# Altium schematic sheet Trepanat_MCU.SchDoc: Трепанат
size 840 x 594 mm; ApprovedBy: Подлесный; CheckedBy: Подлесный; CompanyName: ВольтПРО; DrawnBy: Подлесный; DocumentNumber: ПРО 2018.001 Э3; SheetNumber: 1; SheetTotal: 7; DocumentType: Схема электрическая принципиальная; Format: A1; ImagePath: Введите номер платы
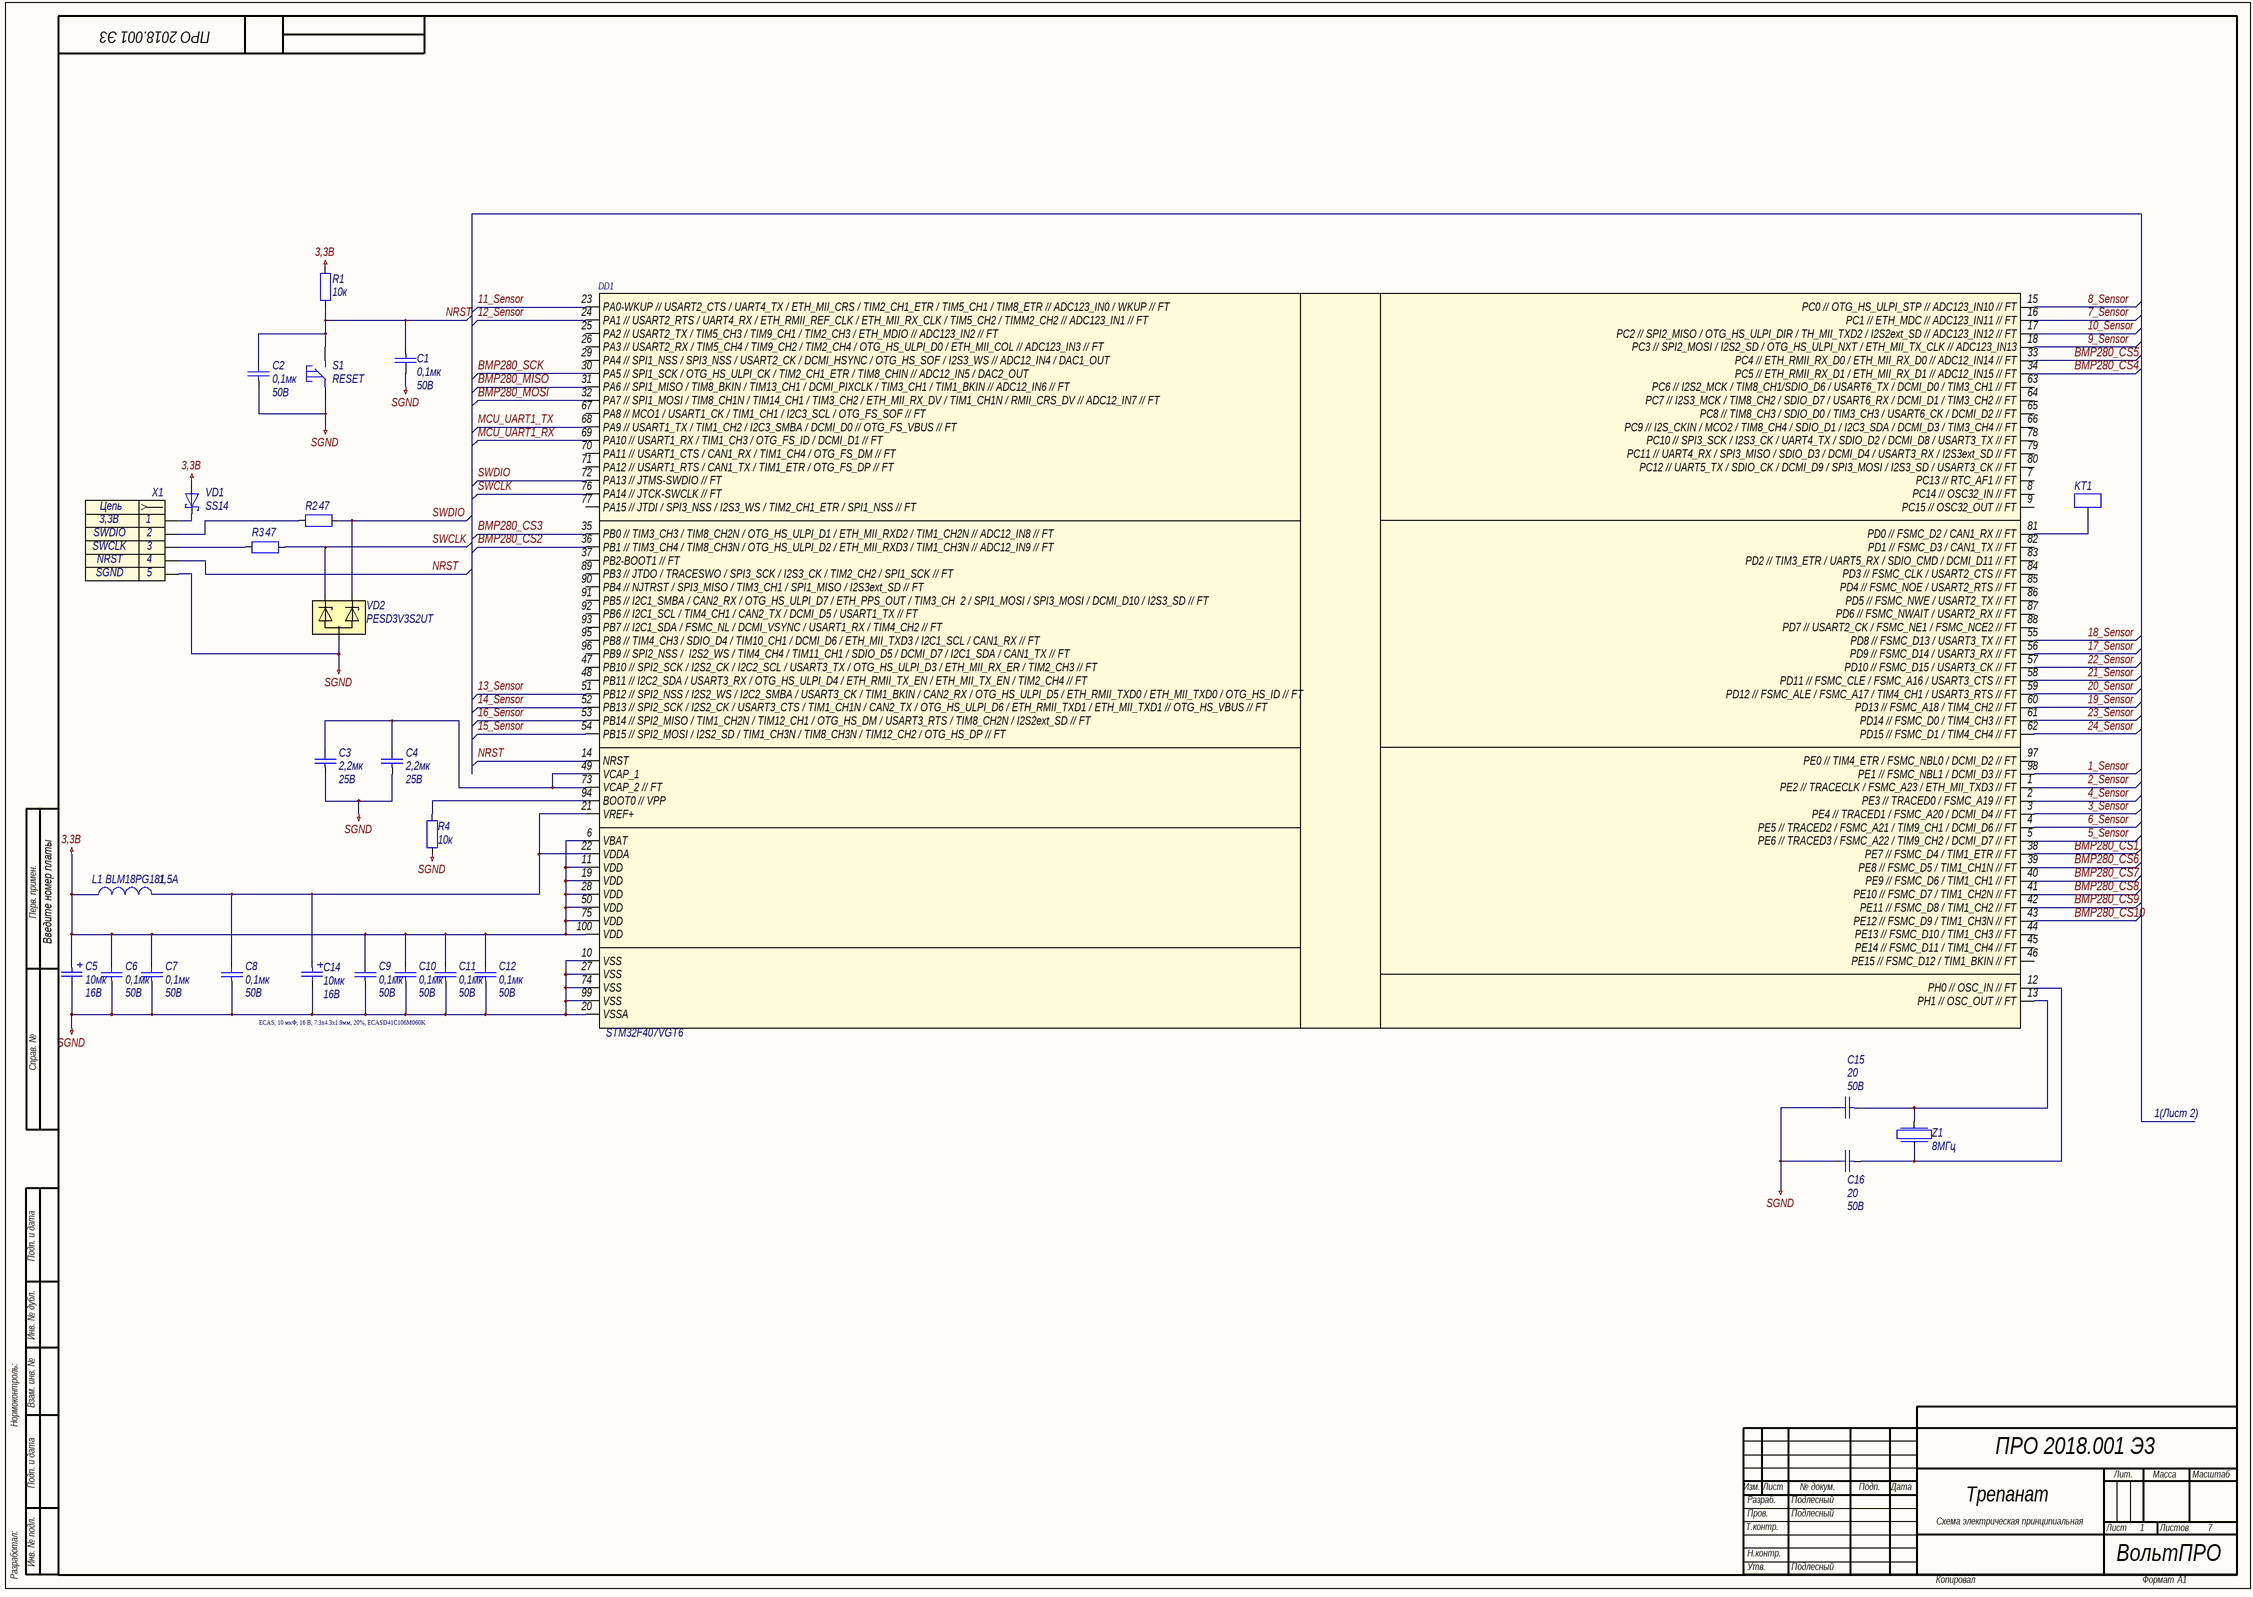
[diagram p0: Trepanat_MCU.SchDoc]

## Parts
C1  0,1мк  Voltage: 50В  [C0805]
C2  0,1мк  Voltage: 50В  [C0805]
C3  2,2мк  Voltage: 25В  [C0805]
C4  2,2мк  Voltage: 25В  [C0805]
C5  Voltage: 16В  [TANTAL CASE D]  (hidden comment: 10мк)
C6  0,1мк  Voltage: 50В  [C0805]
C7  0,1мк  Voltage: 50В  [C0805]
C8  0,1мк  Voltage: 50В  [C0805]
C9  0,1мк  Voltage: 50В  [C0805]
C10  0,1мк  Voltage: 50В  [C0805]
C11  0,1мк  Voltage: 50В  [C0805]
C12  0,1мк  Voltage: 50В  [C0805]
C14  Voltage: 16В  [TANTAL CASE D]  (hidden comment: 10мк)
C15  20  Voltage: 50В  [C0805]
C16  Voltage: 50В  [C0805]  (hidden comment: 20)
DD1  (no value)  [LQPF100]
KT1  KT  [КТ]  (value not drawn)
L1  BLM18PG181  Imax: 1,5A  [L0603]
R1  10к  [R0805]
R2  47  [R0805]
R3  47  [R0805]
R4  10к  [R0805]
S1  RESET  [Button_SMD]
VD1  SS14  [SMA]
VD2  PESD3V3S2UT  [SOT23-3]
X1  (no value)  [PLS-5]
Z1  8МГц  [QSMD5.0x3.2x1.0]

## Nets
3,3B: C5.1 C6.2 C7.2 C9.2 C10.2 C11.2 C12.2 DD1.6(VBAT) DD1.11(VDD) DD1.19(VDD) DD1.28(VDD) DD1.50(VDD) DD1.75(VDD) DD1.100(VDD) L1.1 R1.2 VD1.2(A)
SGND: C1.2 C2.1 C3.1 C4.1 C5.2 C6.1 C7.1 C8.1 C9.1 C10.1 C11.1 C12.1 C14.2 C15.2 C16.2 DD1.10(VSS) DD1.20(VSSA) DD1.27(VSS) DD1.74(VSS) DD1.99(VSS) R4.2 S1.1 VD2.3 X1.5
1_Sensor: DD1.98(PE1_//_FSMC_NBL1_/_DCMI_D3_//_FT)
2_Sensor: DD1.1(PE2_//_TRACECLK_/_FSMC_A23_/_ETH_MII_TXD3_//_FT)
3_Sensor: DD1.3(PE4_//_TRACED1_/_FSMC_A20_/_DCMI_D4_//_FT)
4_Sensor: DD1.2(PE3_//_TRACED0_/_FSMC_A19_//_FT)
5_Sensor: DD1.5(PE6_//_TRACED3_/_FSMC_A22_/_TIM9_CH2_/_DCMI_D7_//_FT)
6_Sensor: DD1.4(PE5_//_TRACED2_/_FSMC_A21_/_TIM9_CH1_/_DCMI_D6_//_FT)
7_Sensor: DD1.16(PC1_//_ETH_MDC_//_ADC123_IN11_//_FT)
8_Sensor: DD1.15(PC0_//_OTG_HS_ULPI_STP_//_ADC123_IN10_//_FT)
9_Sensor: DD1.18(PC3_//_SPI2_MOSI_/_I2S2_SD_/_OTG_HS_ULPI_NXT_/_ETH_MII_TX_CLK_//_ADC123_IN13)
10_Sensor: DD1.17(PC2_//_SPI2_MISO_/_OTG_HS_ULPI_DIR_/_TH_MII_TXD2_/_I2S2ext_SD_//_ADC123_IN12_//_FT)
11_Sensor: DD1.23(PA0-WKUP_//_USART2_CTS_/_UART4_TX_/_ETH_MII_CRS_/_TIM2_CH1_ETR_/_TIM5_CH1_/_TIM8_ETR_//_ADC123_IN0_/_WKUP_//_FT)
12_Sensor: DD1.24(PA1_//_USART2_RTS_/_UART4_RX_/_ETH_RMII_REF_CLK_/_ETH_MII_RX_CLK_/_TIM5_CH2_/_TIMM2_CH2_//_ADC123_IN1_//_FT)
13_Sensor: DD1.51(PB12_//_SPI2_NSS_/_I2S2_WS_/_I2C2_SMBA_/_USART3_CK_/_TIM1_BKIN_/_CAN2_RX_/_OTG_HS_ULPI_D5_/_ETH_RMII_TXD0_/_ETH_MII_TXD0_/_OTG_HS_ID_//_FT)
14_Sensor: DD1.52(PB13_//_SPI2_SCK_/_I2S2_CK_/_USART3_CTS_/_TIM1_CH1N_/_CAN2_TX_/_OTG_HS_ULPI_D6_/_ETH_RMII_TXD1_/_ETH_MII_TXD1_//_OTG_HS_VBUS_//_FT)
15_Sensor: DD1.54(PB15_//_SPI2_MOSI_/_I2S2_SD_/_TIM1_CH3N_/_TIM8_CH3N_/_TIM12_CH2_/_OTG_HS_DP_//_FT)
16_Sensor: DD1.53(PB14_//_SPI2_MISO_/_TIM1_CH2N_/_TIM12_CH1_/_OTG_HS_DM_/_USART3_RTS_/_TIM8_CH2N_/_I2S2ext_SD_//_FT)
17_Sensor: DD1.56(PD9_//_FSMC_D14_/_USART3_RX_//_FT)
18_Sensor: DD1.55(PD8_//_FSMC_D13_/_USART3_TX_//_FT)
19_Sensor: DD1.60(PD13_//_FSMC_A18_/_TIM4_CH2_//_FT)
20_Sensor: DD1.59(PD12_//_FSMC_ALE_/_FSMC_A17_/_TIM4_CH1_/_USART3_RTS_//_FT)
21_Sensor: DD1.58(PD11_//_FSMC_CLE_/_FSMC_A16_/_USART3_CTS_//_FT)
22_Sensor: DD1.57(PD10_//_FSMC_D15_/_USART3_CK_//_FT)
23_Sensor: DD1.61(PD14_//_FSMC_D0_/_TIM4_CH3_//_FT)
24_Sensor: DD1.62(PD15_//_FSMC_D1_/_TIM4_CH4_//_FT)
BMP280_CS1: DD1.38(PE7_//_FSMC_D4_/_TIM1_ETR_//_FT)
BMP280_CS2: DD1.36(PB1_//_TIM3_CH4_/_TIM8_CH3N_/_OTG_HS_ULPI_D2_/_ETH_MII_RXD3_/_TIM1_CH3N_//_ADC12_IN9_//_FT)
BMP280_CS3: DD1.35(PB0_//_TIM3_CH3_/_TIM8_CH2N_/_OTG_HS_ULPI_D1_/_ETH_MII_RXD2_/_TIM1_CH2N_//_ADC12_IN8_//_FT)
BMP280_CS4: DD1.34(PC5_//_ETH_RMII_RX_D1_/_ETH_MII_RX_D1_//_ADC12_IN15_//_FT)
BMP280_CS5: DD1.33(PC4_//_ETH_RMII_RX_D0_/_ETH_MII_RX_D0_//_ADC12_IN14_//_FT)
BMP280_CS6: DD1.39(PE8_//_FSMC_D5_/_TIM1_CH1N_//_FT)
BMP280_CS7: DD1.40(PE9_//_FSMC_D6_/_TIM1_CH1_//_FT)
BMP280_CS8: DD1.41(PE10_//_FSMC_D7_/_TIM1_CH2N_//_FT)
BMP280_CS9: DD1.42(PE11_//_FSMC_D8_/_TIM1_CH2_//_FT)
BMP280_CS10: DD1.43(PE12_//_FSMC_D9_/_TIM1_CH3N_//_FT)
BMP280_MISO: DD1.31(PA6_//_SPI1_MISO_/_TIM8_BKIN_/_TIM13_CH1_/_DCMI_PIXCLK_/_TIM3_CH1_/_TIM1_BKIN_//_ADC12_IN6_//_FT)
BMP280_MOSI: DD1.32(PA7_//_SPI1_MOSI_/_TIM8_CH1N_/_TIM14_CH1_/_TIM3_CH2_/_ETH_MII_RX_DV_/_TIM1_CH1N_/_RMII_CRS_DV_//_ADC12_IN7_//_FT)
BMP280_SCK: DD1.30(PA5_//_SPI1_SCK_/_OTG_HS_ULPI_CK_/_TIM2_CH1_ETR_/_TIM8_CHIN_//_ADC12_IN5_/_DAC2_OUT)
MCU_UART1_RX: DD1.69(PA10_//_USART1_RX_/_TIM1_CH3_/_OTG_FS_ID_/_DCMI_D1_//_FT)
MCU_UART1_TX: DD1.68(PA9_//_USART1_TX_/_TIM1_CH2_/_I2C3_SMBA_/_DCMI_D0_//_OTG_FS_VBUS_//_FT)
NRST: C1.1 C2.2 DD1.14(NRST) R1.1 S1.4 X1.4
SWCLK: DD1.76(PA14_//_JTCK-SWCLK_//_FT) R3.1 VD2.1
SWDIO: DD1.72(PA13_//_JTMS-SWDIO_//_FT) R2.1 VD2.2
NetC3_2: C3.2 C4.2 DD1.49(VCAP_1) DD1.73(VCAP_2_//_FT)
NetC8_2: C8.2 C14.1 DD1.21(VREF+) DD1.22(VDDA) L1.2
NetC15_1: C15.1 DD1.13(PH1_//_OSC_OUT_//_FT) Z1.2
NetC16_1: C16.1 DD1.12(PH0_//_OSC_IN_//_FT) Z1.1
NetDD1_81: DD1.81(PD0_//_FSMC_D2_/_CAN1_RX_//_FT) KT1.1
NetDD1_94: DD1.94(BOOT0_//_VPP) R4.1
NetR2_2: R2.2 X1.2
NetR3_2: R3.2 X1.3
NetVD1_1: VD1.1(K) X1.1

Not connected (* = marked no-connect by the designer): DD1 7(PC13_//_RTC_AF1_//_FT) 8(PC14_//_OSC32_IN_//_FT) 9(PC15_//_OSC32_OUT_//_FT) 25(PA2_//_USART2_TX_/_TIM5_CH3_/_TIM9_CH1_/_TIM2_CH3_/_ETH_MDIO_//_ADC123_IN2_//_FT) 26(PA3_//_USART2_RX_/_TIM5_CH4_/_TIM9_CH2_/_TIM2_CH4_/_OTG_HS_ULPI_D0_/_ETH_MII_COL_//_ADC123_IN3_//_FT) 29(PA4_//_SPI1_NSS_/_SPI3_NSS_/_USART2_CK_/_DCMI_HSYNC_/_OTG_HS_SOF_/_I2S3_WS_//_ADC12_IN4_/_DAC1_OUT) 37(PB2-BOOT1_//_FT) 44(PE13_//_FSMC_D10_/_TIM1_CH3_//_FT) 45(PE14_//_FSMC_D11_/_TIM1_CH4_//_FT) 46(PE15_//_FSMC_D12_/_TIM1_BKIN_//_FT) 47(PB10_//_SPI2_SCK_/_I2S2_CK_/_I2C2_SCL_/_USART3_TX_/_OTG_HS_ULPI_D3_/_ETH_MII_RX_ER_/_TIM2_CH3_//_FT) 48(PB11_//_I2C2_SDA_/_USART3_RX_/_OTG_HS_ULPI_D4_/_ETH_RMII_TX_EN_/_ETH_MII_TX_EN_/_TIM2_CH4_//_FT) 63(PC6_//_I2S2_MCK_/_TIM8_CH1/SDIO_D6_/_USART6_TX_/_DCMI_D0_/_TIM3_CH1_//_FT) 64(PC7_//_I2S3_MCK_/_TIM8_CH2_/_SDIO_D7_/_USART6_RX_/_DCMI_D1_/_TIM3_CH2_//_FT) 65(PC8_//_TIM8_CH3_/_SDIO_D0_/_TIM3_CH3_/_USART6_CK_/_DCMI_D2_//_FT) 66(PC9_//_I2S_CKIN_/_MCO2_/_TIM8_CH4_/_SDIO_D1_/_I2C3_SDA_/_DCMI_D3_/_TIM3_CH4_//_FT) 67(PA8_//_MCO1_/_USART1_CK_/_TIM1_CH1_/_I2C3_SCL_/_OTG_FS_SOF_//_FT) 70(PA11_//_USART1_CTS_/_CAN1_RX_/_TIM1_CH4_/_OTG_FS_DM_//_FT) 71(PA12_//_USART1_RTS_/_CAN1_TX_/_TIM1_ETR_/_OTG_FS_DP_//_FT) 77(PA15_//_JTDI_/_SPI3_NSS_/_I2S3_WS_/_TIM2_CH1_ETR_/_SPI1_NSS_//_FT) 78(PC10_//_SPI3_SCK_/_I2S3_CK_/_UART4_TX_/_SDIO_D2_/_DCMI_D8_/_USART3_TX_//_FT) 79(PC11_//_UART4_RX_/_SPI3_MISO_/_SDIO_D3_/_DCMI_D4_/_USART3_RX_/_I2S3ext_SD_//_FT) 80(PC12_//_UART5_TX_/_SDIO_CK_/_DCMI_D9_/_SPI3_MOSI_/_I2S3_SD_/_USART3_CK_//_FT) 82(PD1_//_FSMC_D3_/_CAN1_TX_//_FT) 83(PD2_//_TIM3_ETR_/_UART5_RX_/_SDIO_CMD_/_DCMI_D11_//_FT) 84(PD3_//_FSMC_CLK_/_USART2_CTS_//_FT) 85(PD4_//_FSMC_NOE_/_USART2_RTS_//_FT) 86(PD5_//_FSMC_NWE_/_USART2_TX_//_FT) 87(PD6_//_FSMC_NWAIT_/_USART2_RX_//_FT) 88(PD7_//_USART2_CK_/_FSMC_NE1_/_FSMC_NCE2_//_FT) 89(PB3_//_JTDO_/_TRACESWO_/_SPI3_SCK_/_I2S3_CK_/_TIM2_CH2_/_SPI1_SCK_//_FT) 90(PB4_//_NJTRST_/_SPI3_MISO_/_TIM3_CH1_/_SPI1_MISO_/_I2S3ext_SD_//_FT) 91(PB5_//_I2C1_SMBA_/_CAN2_RX_/_OTG_HS_ULPI_D7_/_ETH_PPS_OUT_/_TIM3_CH__2_/_SPI1_MOSI_/_SPI3_MOSI_/_DCMI_D10_/_I2S3_SD_//_FT) 92(PB6_//_I2C1_SCL_/_TIM4_CH1_/_CAN2_TX_/_DCMI_D5_/_USART1_TX_//_FT) 93(PB7_//_I2C1_SDA_/_FSMC_NL_/_DCMI_VSYNC_/_USART1_RX_/_TIM4_CH2_//_FT) 95(PB8_//_TIM4_CH3_/_SDIO_D4_/_TIM10_CH1_/_DCMI_D6_/_ETH_MII_TXD3_/_I2C1_SCL_/_CAN1_RX_//_FT) 96(PB9_//_SPI2_NSS_/__I2S2_WS_/_TIM4_CH4_/_TIM11_CH1_/_SDIO_D5_/_DCMI_D7_/_I2C1_SDA_/_CAN1_TX_//_FT) 97(PE0_//_TIM4_ETR_/_FSMC_NBL0_/_DCMI_D2_//_FT)

## Notes on the sheet
- Перв. примен.
- ECAS, 10 мкФ, 16 В, 7.3х4.3х1.9мм, 20%, ECASD41C106M060K
- Справ. №
- 1(Лист 2)
- Подп. и дата
- Инв. № дубл.
- Нормоконтроль:
- Взам. инв. №
- Изм.
- Лист
- № докум.
- Подп.
- Дата
- Лит.
- Масса
- Масштаб
- Т.контр.
- Пров.
- Разраб.
- Листов
- Разработал:
- Инв. № подл.
- Н.контр.
- ВольтПРО
- Утв.
- Копировал
- Формат
- (in symbol Header_5_sct) Цепь

## Library data of the parts
C1-C4 C6-C12 C15 C16 = Capacitor: Конденсатор
  C1 C2 C6-C12: Value: 0,1мк
  C3 C4: Value: 2,2мк
  C15 C16: Value: 20
C5 C14 = Capacitor_pol: Конденсатор полярный; Value: 10мк
DD1 = STM32F407VGT6: Микроконтроллер
KT1 = KT: Контрольная точка
L1 = Inductor: Катушка индуктивности; Value: XXX; Name: BLM18PG181
R1-R4 = Resistor: Резистор
  R1 R4: Value: 10к
  R2 R3: Value: 47
S1 = Button_SMD: Кнопка; Name: RESET
VD1 = DiodeSchottky: Диод Шоттки; Name: SS14
VD2 = PESD3V3S2UT: Сборка TVS-диодов; Name: PESD3V3S2UT
X1 = Header_5_sct: Разъем - 4 конт. розетка; Contact_1: 3,3B; Contact_2: SWDIO; Contact_3: SWCLK; Contact_4: NRST; Contact_5: SGND
Z1 = Crystal: Кварцевый резонатор; Value: 8МГц